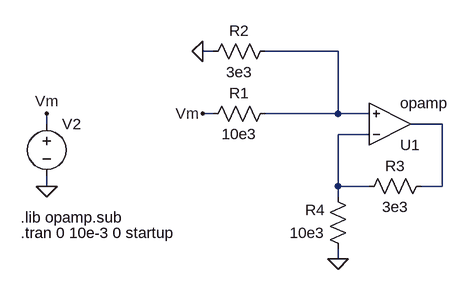
[diagram p0: schematic noninv-amplifier-vm.asc]
noninv-amplifier-vm.asc, the LTspice schematic file:
Version 4
SHEET 1 880 680
WIRE 208 0 192 0
WIRE 400 0 288 0
WIRE 208 96 192 96
WIRE 400 96 400 0
WIRE 400 96 288 96
WIRE 448 96 400 96
WIRE -48 112 -48 96
WIRE 560 112 512 112
WIRE 448 128 400 128
WIRE -48 208 -48 192
WIRE 400 208 400 128
WIRE 448 208 400 208
WIRE 560 208 560 112
WIRE 560 208 528 208
WIRE 400 224 400 208
WIRE 400 320 400 304
FLAG 400 320 0
FLAG -48 208 0
FLAG -48 96 Vm
FLAG 192 96 Vm
FLAG 192 0 0
SYMBOL OpAmps\\opamp 480 176 M180
SYMATTR InstName U1
SYMBOL res 304 80 R90
WINDOW 0 0 56 VBottom 2
WINDOW 3 32 56 VTop 2
SYMATTR InstName R1
SYMATTR Value 10e3
SYMBOL res 304 -16 R90
WINDOW 0 0 56 VBottom 2
WINDOW 3 32 56 VTop 2
SYMATTR InstName R2
SYMATTR Value 3e3
SYMBOL res 544 192 R90
WINDOW 0 0 56 VBottom 2
WINDOW 3 32 56 VTop 2
SYMATTR InstName R3
SYMATTR Value 3e3
SYMBOL res 416 320 R180
WINDOW 0 36 76 Left 2
WINDOW 3 36 40 Left 2
SYMATTR InstName R4
SYMATTR Value 10e3
SYMBOL voltage -48 96 R0
WINDOW 39 0 0 Left 0
WINDOW 3 24 96 Invisible 2
SYMATTR Value SINE(5 5 1e3)
SYMATTR InstName V2
SYMATTR Value2 AC 1
TEXT -88 256 Left 2 !.lib opamp.sub
TEXT -88 280 Left 2 !.tran 0 10e-3 0 startup

The netlist it stands for:
* noninv-amplifier-vm.asc
XU1 N003 N001 N002 opamp Aol=100K GBW=10Meg  ; pins invin noninvin out
R1 N001 Vm 10e3
R2 N001 0 3e3
R3 N002 N003 3e3
R4 0 N003 10e3
V2 Vm 0 SINE(5 5 1e3) AC 1
.lib opamp.sub
.tran 0 10e-3 0 startup
.backanno
.end